# Altium schematic sheet 1 - MCU.SchDoc: Atmel Energy Metering Demo Board
size A3; DrawnBy: Felix Yao; Organization: Smart Energy; Revision: 1.0; SheetNumber: 1; SheetTotal: 3; PageSetup: Record=PageOptions|CenterHorizontal=True|CenterVertical=True|PrintScale=0.71|XCorrection=1.00|YCorrection=1.00|PrintKind=1|BorderSize=5000000|LeftOffset=0|BottomOffset=0|Orientation=2|PaperLength=2969|PaperWidth=2100|Scale=100|PaperSource=7|PrintQuality=600|MediaType=1|DitherType=10|PaperKind=A4 (210 x 297 mm)|PrintScaleMode=1
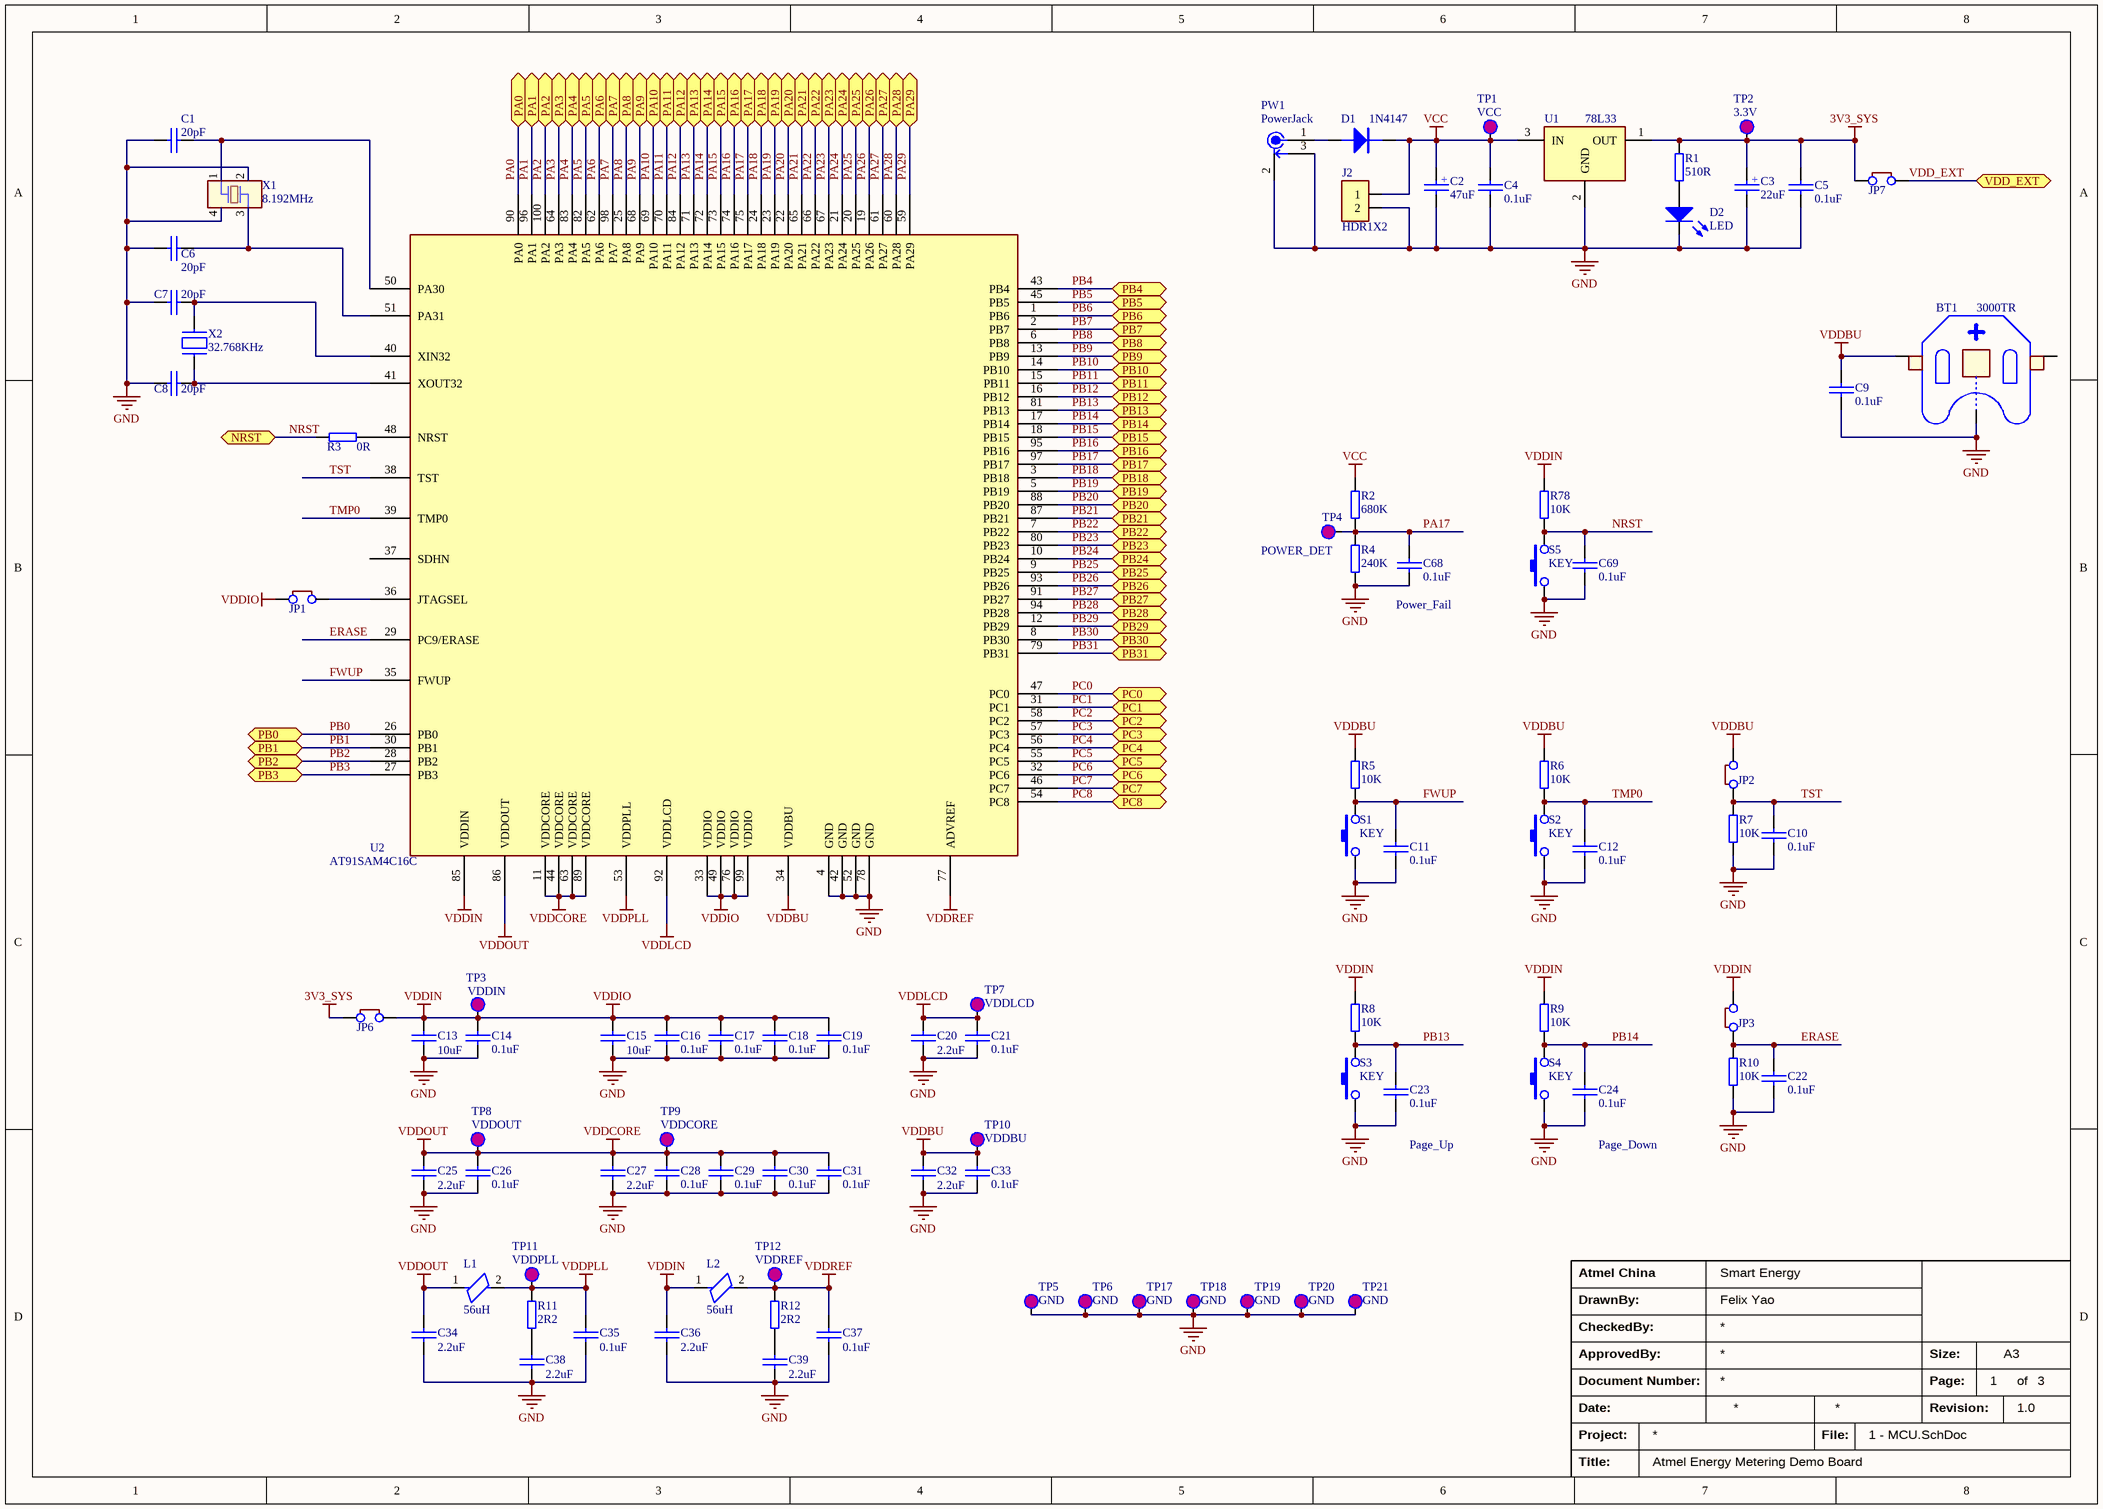
[diagram p0: 1 - MCU.SchDoc]

## Parts
BT1  3000TR  [X-S_3000_01]
C1  20pF  [C0603]
C2  47uF  [C_TANT_B3528]
C3  22uF  [C_TANT_B3528]
C4  0.1uF  [C0603]
C5  0.1uF  [C0603]
C6  20pF  [C0603]
C7  20pF  [C0603]
C8  20pF  [C0603]
C9  0.1uF  [C0603]
C10  0.1uF  [C0603]
C11  0.1uF  [C0603]
C12  0.1uF  [C0603]
C13  10uF  [C0805]
C14  0.1uF  [C0603]
C15  10uF  [C0805]
C16  0.1uF  [C0603]
C17  0.1uF  [C0603]
C18  0.1uF  [C0603]
C19  0.1uF  [C0603]
C20  2.2uF  [C0805]
C21  0.1uF  [C0603]
C22  0.1uF  [C0603]
C23  0.1uF  [C0603]
C24  0.1uF  [C0603]
C25  2.2uF  [C0805]
C26  0.1uF  [C0603]
C27  2.2uF  [C0805]
C28  0.1uF  [C0603]
C29  0.1uF  [C0603]
C30  0.1uF  [C0603]
C31  0.1uF  [C0603]
C32  2.2uF  [C0805]
C33  0.1uF  [C0603]
C34  2.2uF  [C0805]
C35  0.1uF  [C0603]
C36  2.2uF  [C0805]
C37  0.1uF  [C0603]
C38  2.2uF  [C0805]
C39  2.2uF  [C0805]
C68  0.1uF  [C0603]
C69  0.1uF  [C0603]
D1  1N4147  [DIODE-SMD]
D2  LED  [LED-0805]
J2  HDR1X2  [HDR1X2(None)]
JP1  JMP  [JMP]  (value not drawn)
JP2  JMP  [JMP]  (value not drawn)
JP3  JMP  [JMP]  (value not drawn)
JP6  JMP  [JMP]  (value not drawn)
JP7  JMP  [JMP]  (value not drawn)
L1  56uH  [1210]
L2  56uH  [1210]
PW1  PowerJack  [PowerJacket2.5]
R1  510R  [R0603]
R2  680K  [R0603]
R3  0R  [R0603]
R4  240K  [R0603]
R5  10K  [R0603]
R6  10K  [R0603]
R7  10K  [R0603]
R8  10K  [R0603]
R9  10K  [R0603]
R10  10K  [R0603]
R11  2R2  [R0603]
R12  2R2  [R0603]
R78  10K  [R0603]
S1  KEY  [KEY-4P - SMD]
S2  KEY  [KEY-4P - SMD]
S3  KEY  [KEY-4P - SMD]
S4  KEY  [KEY-4P - SMD]
S5  KEY  [KEY-4P - SMD]
TP1  VCC  [TP]
TP2  3.3V  [TP]
TP3  VDDIN  [TP]
TP4  POWER_DET  [TP]
TP5  GND  [TP]
TP6  GND  [TP]
TP7  VDDLCD  [TP]
TP8  VDDOUT  [TP]
TP9  VDDCORE  [TP]
TP10  VDDBU  [TP]
TP11  VDDPLL  [TP]
TP12  VDDREF  [TP]
TP17  GND  [TP]
TP18  GND  [TP]
TP19  GND  [TP]
TP20  GND  [TP]
TP21  GND  [TP]
U1  78L33  [SOT-89]
U2  AT91SAM4C16C  [LQFP-100]
X1  8.192MHz  [crystal_5032]
X2  32.768KHz  [CFPX-217]

## Ports
NRST (bidir), PA0 (bidir), PA1 (bidir), PA2 (bidir), PA3 (bidir), PA4 (bidir), PA5 (bidir), PA6 (bidir), PA7 (bidir), PA8 (bidir), PA9 (bidir), PA10 (bidir), PA11 (bidir), PA12 (bidir), PA13 (bidir), PA14 (bidir), PA15 (bidir), PA16 (bidir), PA17 (bidir), PA18 (bidir), PA19 (bidir), PA20 (bidir), PA21 (bidir), PA22 (bidir), PA23 (bidir), PA24 (bidir), PA25 (bidir), PA26 (bidir), PA27 (bidir), PA28 (bidir), PA29 (bidir), PB0 (bidir), PB1 (bidir), PB2 (bidir), PB3 (bidir), PB4 (bidir), PB5 (bidir), PB6 (bidir), PB7 (bidir), PB8 (bidir), PB9 (bidir), PB10 (bidir), PB11 (bidir), PB12 (bidir), PB13 (bidir), PB14 (bidir), PB15 (bidir), PB16 (bidir), PB17 (bidir), PB18 (bidir), PB19 (bidir), PB20 (bidir), PB21 (bidir), PB22 (bidir), PB23 (bidir), PB24 (bidir), PB25 (bidir), PB26 (bidir), PB27 (bidir), PB28 (bidir), PB29 (bidir), PB30 (bidir), PB31 (bidir), PC0 (bidir), PC1 (bidir), PC2 (bidir), PC3 (bidir), PC4 (bidir), PC5 (bidir), PC6 (bidir), PC7 (bidir), PC8 (bidir), VDD_EXT (bidir)

## Nets
3V3_SYS: C3.1 C5.2 JP6.1 JP7.1 R1.2 TP2.1 U1.1(OUT)
GND: BT1.1(M) C1.1 C2.2 C3.2 C4.1 C5.1 C6.1 C7.1 C8.1 C9.1 C10.1 C11.1 C12.1 C13.1 C14.1 C15.1 C16.1 C17.1 C18.1 C19.1 C20.1 C21.1 C22.1 C23.1 C24.1 C25.1 C26.1 C27.1 C28.1 C29.1 C30.1 C31.1 C32.1 C33.1 C34.1 C35.1 C36.1 C37.1 C38.1 C39.1 C68.1 C69.1 D2.K J2.2 PW1.2 PW1.3 R4.1 R7.2 R10.2 S1.1 S2.1 S3.1 S4.1 S5.1 TP5.1 TP6.1 TP17.1 TP18.1 TP19.1 TP20.1 TP21.1 U1.2(GND) U2.4(GND) U2.42(GND) U2.52(GND) U2.78(GND) X1.2 X1.4
VCC: C2.1 C4.2 D1.K J2.1 R2.2 TP1.1 U1.3(IN)
VDDBU: BT1.3(P2) C9.2 C32.2 C33.2 JP2.2 R5.2 R6.2 TP10.1 U2.34(VDDBU)
VDDCORE: C25.2 C26.2 C27.2 C28.2 C29.2 C30.2 C31.2 C34.2 L1.1 TP8.1 TP9.1 U2.11(VDDCORE) U2.44(VDDCORE) U2.63(VDDCORE) U2.86(VDDOUT) U2.89(VDDCORE)  [also labelled VDDOUT]
VDDIN: C13.2 C14.2 C15.2 C16.2 C17.2 C18.2 C19.2 C36.2 JP1.1 JP3.2 JP6.2 L2.1 R8.2 R9.2 R78.2 TP3.1 U2.33(VDDIO) U2.49(VDDIO) U2.76(VDDIO) U2.85(VDDIN) U2.99(VDDIO)  [also labelled VDDIO]
VDDLCD: C20.2 C21.2 TP7.1 U2.92(VDDLCD)
VDDPLL: C35.2 L1.2 R11.2 TP11.1 U2.53(VDDPLL)
VDDREF: C37.2 L2.2 R12.2 TP12.1 U2.77(ADVREF)
ERASE: C22.2 JP3.1 R10.1 U2.29(PC9/ERASE)
FWUP: C11.2 R5.1 S1.2 U2.35(FWUP)
NRST: C69.2 R3.2 R78.1 S5.2 ; port NRST
PA0: U2.90(PA0) ; port PA0
PA1: U2.96(PA1) ; port PA1
PA2: U2.100(PA2) ; port PA2
PA3: U2.64(PA3) ; port PA3
PA4: U2.83(PA4) ; port PA4
PA5: U2.82(PA5) ; port PA5
PA6: U2.62(PA6) ; port PA6
PA7: U2.98(PA7) ; port PA7
PA8: U2.25(PA8) ; port PA8
PA9: U2.68(PA9) ; port PA9
PA10: U2.69(PA10) ; port PA10
PA11: U2.70(PA11) ; port PA11
PA12: U2.84(PA12) ; port PA12
PA13: U2.71(PA13) ; port PA13
PA14: U2.72(PA14) ; port PA14
PA15: U2.73(PA15) ; port PA15
PA16: U2.74(PA16) ; port PA16
PA17: C68.2 R2.1 R4.2 TP4.1 U2.75(PA17) ; port PA17
PA18: U2.24(PA18) ; port PA18
PA19: U2.23(PA19) ; port PA19
PA20: U2.22(PA20) ; port PA20
PA21: U2.65(PA21) ; port PA21
PA22: U2.66(PA22) ; port PA22
PA23: U2.67(PA23) ; port PA23
PA24: U2.21(PA24) ; port PA24
PA25: U2.20(PA25) ; port PA25
PA26: U2.19(PA26) ; port PA26
PA27: U2.61(PA27) ; port PA27
PA28: U2.60(PA28) ; port PA28
PA29: U2.59(PA29) ; port PA29
PB0: U2.26(PB0) ; port PB0
PB1: U2.30(PB1) ; port PB1
PB2: U2.28(PB2) ; port PB2
PB3: U2.27(PB3) ; port PB3
PB4: U2.43(PB4) ; port PB4
PB5: U2.45(PB5) ; port PB5
PB6: U2.1(PB6) ; port PB6
PB7: U2.2(PB7) ; port PB7
PB8: U2.6(PB8) ; port PB8
PB9: U2.13(PB9) ; port PB9
PB10: U2.14(PB10) ; port PB10
PB11: U2.15(PB11) ; port PB11
PB12: U2.16(PB12) ; port PB12
PB13: C23.2 R8.1 S3.2 U2.81(PB13) ; port PB13
PB14: C24.2 R9.1 S4.2 U2.17(PB14) ; port PB14
PB15: U2.18(PB15) ; port PB15
PB16: U2.95(PB16) ; port PB16
PB17: U2.97(PB17) ; port PB17
PB18: U2.3(PB18) ; port PB18
PB19: U2.5(PB19) ; port PB19
PB20: U2.88(PB20) ; port PB20
PB21: U2.87(PB21) ; port PB21
PB22: U2.7(PB22) ; port PB22
PB23: U2.80(PB23) ; port PB23
PB24: U2.10(PB24) ; port PB24
PB25: U2.9(PB25) ; port PB25
PB26: U2.93(PB26) ; port PB26
PB27: U2.91(PB27) ; port PB27
PB28: U2.94(PB28) ; port PB28
PB29: U2.12(PB29) ; port PB29
PB30: U2.8(PB30) ; port PB30
PB31: U2.79(PB31) ; port PB31
PC0: U2.47(PC0) ; port PC0
PC1: U2.31(PC1) ; port PC1
PC2: U2.58(PC2) ; port PC2
PC3: U2.57(PC3) ; port PC3
PC4: U2.56(PC4) ; port PC4
PC5: U2.55(PC5) ; port PC5
PC6: U2.32(PC6) ; port PC6
PC7: U2.46(PC7) ; port PC7
PC8: U2.54(PC8) ; port PC8
TMP0: C12.2 R6.1 S2.2 U2.39(TMP0)
TST: C10.2 JP2.1 R7.1 U2.38(TST)
VDD_EXT: JP7.2 ; port VDD_EXT
NetC1_2: C1.2 U2.50(PA30) X1.1
NetC6_2: C6.2 U2.51(PA31) X1.3
NetC7_2: C7.2 U2.40(XIN32) X2.1
NetC8_2: C8.2 U2.41(XOUT32) X2.2
NetC38_2: C38.2 R11.1
NetC39_2: C39.2 R12.1
NetD1_A: D1.A PW1.1
NetD2_A: D2.A R1.1
NetJP1_2: JP1.2 U2.36(JTAGSEL)
NetR3_1: R3.1 U2.48(NRST)

Not connected (* = marked no-connect by the designer): BT1 2(P1); U2 37(SDHN)

## Notes on the sheet
- (near C68) Power_Fail
- Page_Up
- Page_Down
- Atmel China
- DrawnBy:
- Document Number:
- CheckedBy:
- ApprovedBy:
- Page:
- Size:
- A3
- of
- Project:
- Date:
- File:
- Revision:
- Title:
- (in symbol CAP-TANT) +

## Library data of the parts
BT1 = Battery Holder CR12_16_20_25: BATTERY HOLDER; Manufacturer: Keystone; Manufacturer Part number: 3000TR; Value: 3000TR
C1 C4-C39 C68 C69 = CAP
C2 C3 = CAP-TANT
D1 = DIODE
L1 L2 = BEAD_ FERRITE: Ferrite Bead,470OHM@100MHz,+/-25%,  200mA,; Manufacturer: Murata; Manufacturer Part number: BLM21BD471SN1; Value: 470ohm @100MHZ
R1-R12 R78 = RES
TP1-TP12 TP17-TP21 = TEST-POINT
U1 = 78LXX
X1 = 12MHz: Crystal,ABM3B-8.192MHz-B2-T,8.192MHz,+/-20PPM,18PF; Manufacturer: Abracon; Manufacturer Part number: ABM3B-8.192MHZ-B2-T; Value: 8.192MHz
X2 = XTAL-T